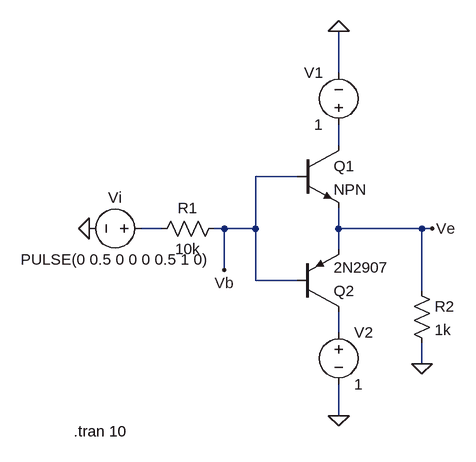
[diagram p0: schematic 3.asc]
3.asc, the LTspice schematic file:
Version 4
SHEET 1 880 680
WIRE 240 -16 240 -80
WIRE 240 96 240 64
WIRE 176 144 112 144
WIRE -32 224 -64 224
WIRE 64 224 48 224
WIRE 112 224 112 144
WIRE 112 224 64 224
WIRE 240 224 240 192
WIRE 368 224 240 224
WIRE 384 224 368 224
WIRE 240 256 240 224
WIRE 64 288 64 224
WIRE 112 304 112 224
WIRE 176 304 112 304
WIRE 368 320 368 224
WIRE 240 384 240 352
WIRE 368 432 368 400
WIRE 240 512 240 464
FLAG 240 -80 0
FLAG 240 512 0
FLAG 64 288 Vb
FLAG 384 224 Ve
FLAG 368 432 0
FLAG -144 224 0
SYMBOL npn 176 96 R0
SYMATTR InstName Q1
SYMBOL voltage 240 80 R180
WINDOW 0 24 96 Left 2
WINDOW 3 24 16 Left 2
WINDOW 123 0 0 Left 0
WINDOW 39 0 0 Left 0
SYMATTR InstName V1
SYMATTR Value 1
SYMBOL pnp 176 352 M180
SYMATTR InstName Q2
SYMATTR Value 2N2907
SYMBOL voltage 240 368 R0
WINDOW 123 0 0 Left 0
WINDOW 39 0 0 Left 0
SYMATTR InstName V2
SYMATTR Value 1
SYMBOL res 64 208 R90
WINDOW 0 0 56 VBottom 2
WINDOW 3 32 56 VTop 2
SYMATTR InstName R1
SYMATTR Value 10k
SYMBOL res 352 304 R0
SYMATTR InstName R2
SYMATTR Value 1k
SYMBOL voltage -48 224 R90
WINDOW 0 -32 56 VBottom 2
WINDOW 3 32 56 VTop 2
WINDOW 123 0 0 Left 0
WINDOW 39 0 0 Left 0
SYMATTR InstName Vi
SYMATTR Value PULSE(0 0.5 0 0 0 0.5 1 0)
TEXT -168 536 Left 2 !.tran 10

The netlist it stands for:
* 3.asc
Q1 N001 Vb Ve 0 NPN
V1 N001 0 1
Q2 N003 Vb Ve 0 2N2907
V2 N003 0 1
R1 Vb N002 10k
R2 Ve 0 1k
Vi N002 0 PULSE(0 0.5 0 0 0 0.5 1 0)
.model NPN NPN
.model PNP PNP
.lib standard.bjt
.tran 10
.backanno
.end